# EAGLE design SD_MMC Breakout-v10 (EAGLE 5.10)
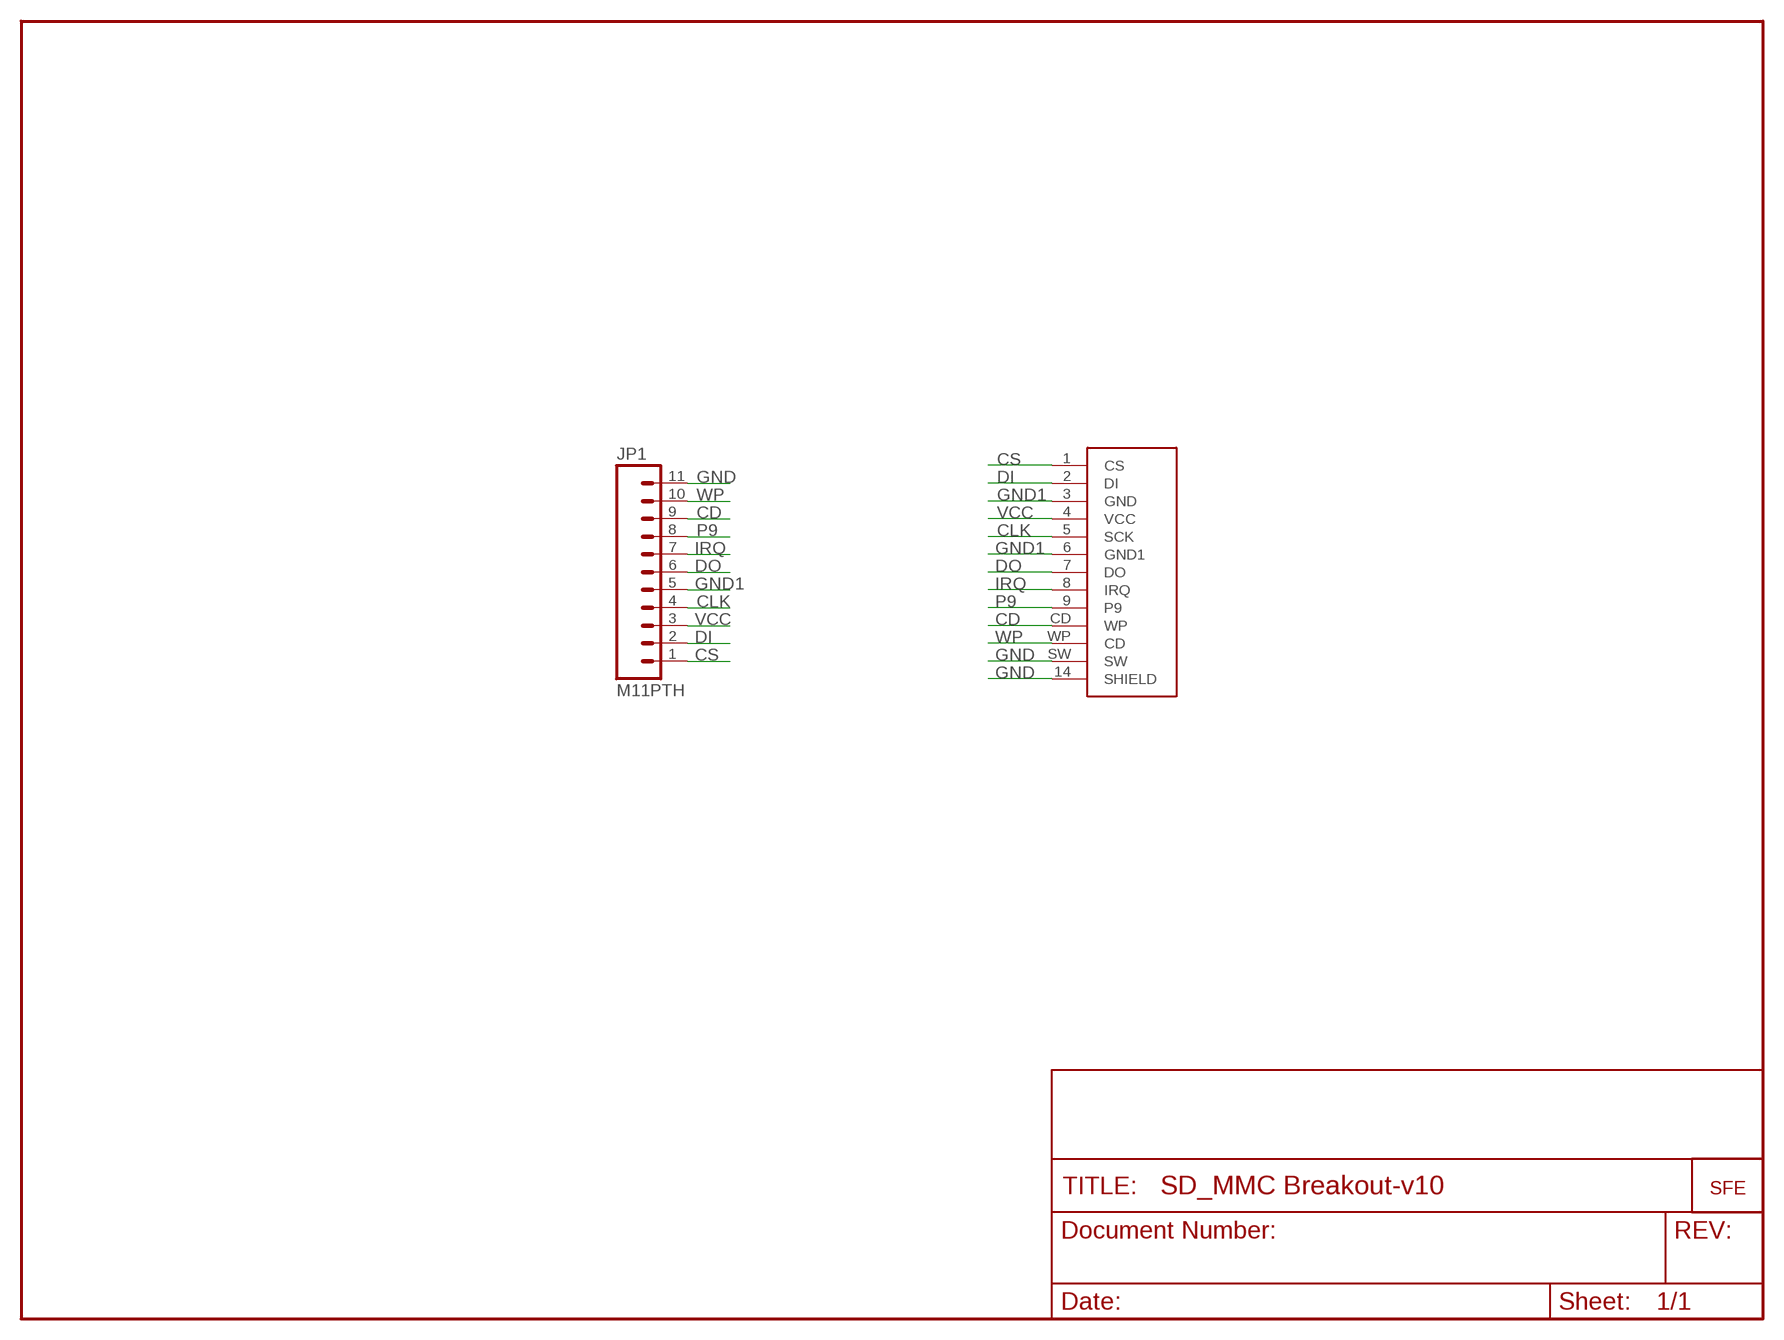
[diagram p0: schematic, sheet 1]

## Parts
JP1  M11PTH  [1X11]
U$1  LOGO-SFENEW  [SFE-NEW-WEBLOGO]
U$2  SD_CARD_SOCKETSD  [SD-MMC_SOCKET-PP]

## Nets
CD: JP1.9 U$2.CD(WP)
CLK: JP1.4 U$2.5(SCK)
CS: JP1.1 U$2.1(CS)
DI: JP1.2 U$2.2(DI)
DO: JP1.6 U$2.7(DO)
GND: JP1.11 U$2.14(SHIELD) U$2.SW
GND1: JP1.5 U$2.3(GND) U$2.6(GND1)
IRQ: JP1.7 U$2.8(IRQ)
P9: JP1.8 U$2.9
VCC: JP1.3 U$2.4(VCC)
WP: JP1.10 U$2.WP(CD)

## Library data of the parts
JP1 = SparkFun:M11: Header 11 Standard 11-pin 0.1" header. Use with straight break away headers (SKU : PRT-00116), right angle break away headers (PRT-00553), swiss pins (PRT-00743), machine pins (PRT-00117), and female headers (PRT-00115).
U$1 = SparkFun:LOGO-SFE: Spark Fun Electronics PCB Logo This is the standard Spark Fun Electronics PCB logo.
U$2 = SparkFun:SD_CARD_SOCKET: SD/MMC Socket Media socket for SD and MMC cards. Push-push type. Schematic element and footprint production proven. Spark Fun Electronics SKU : PRT-00136

## Board
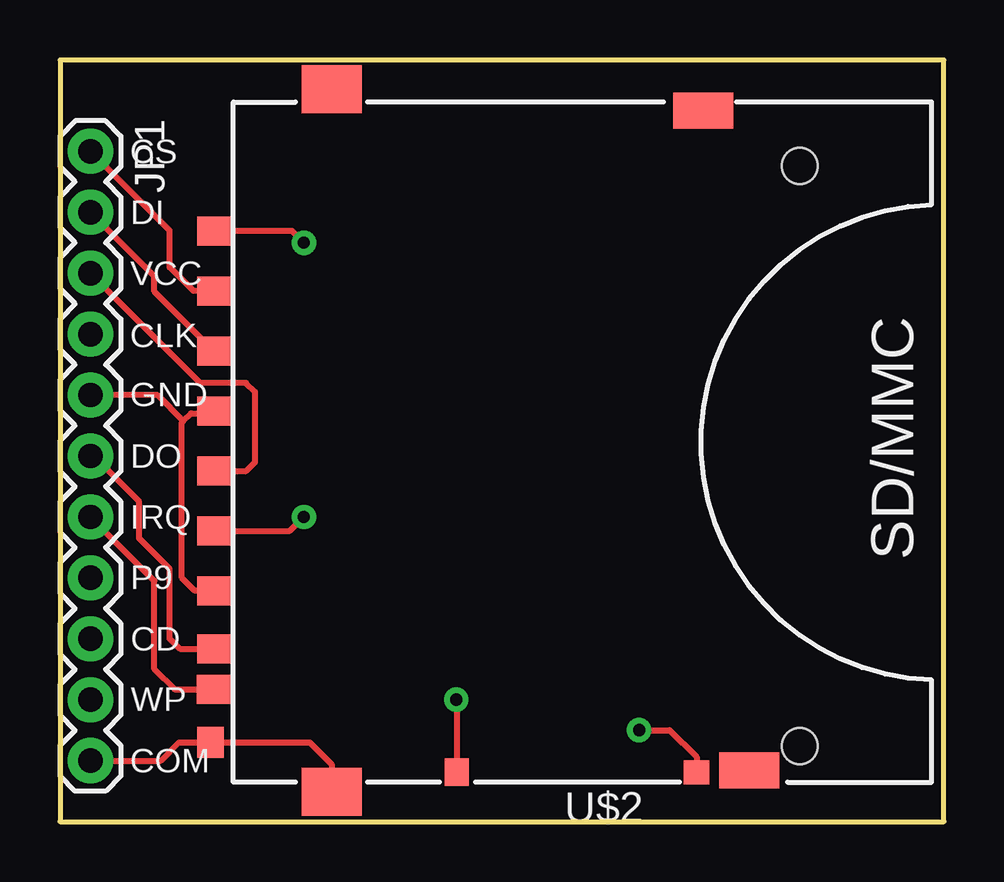
[diagram p1: board, top side]
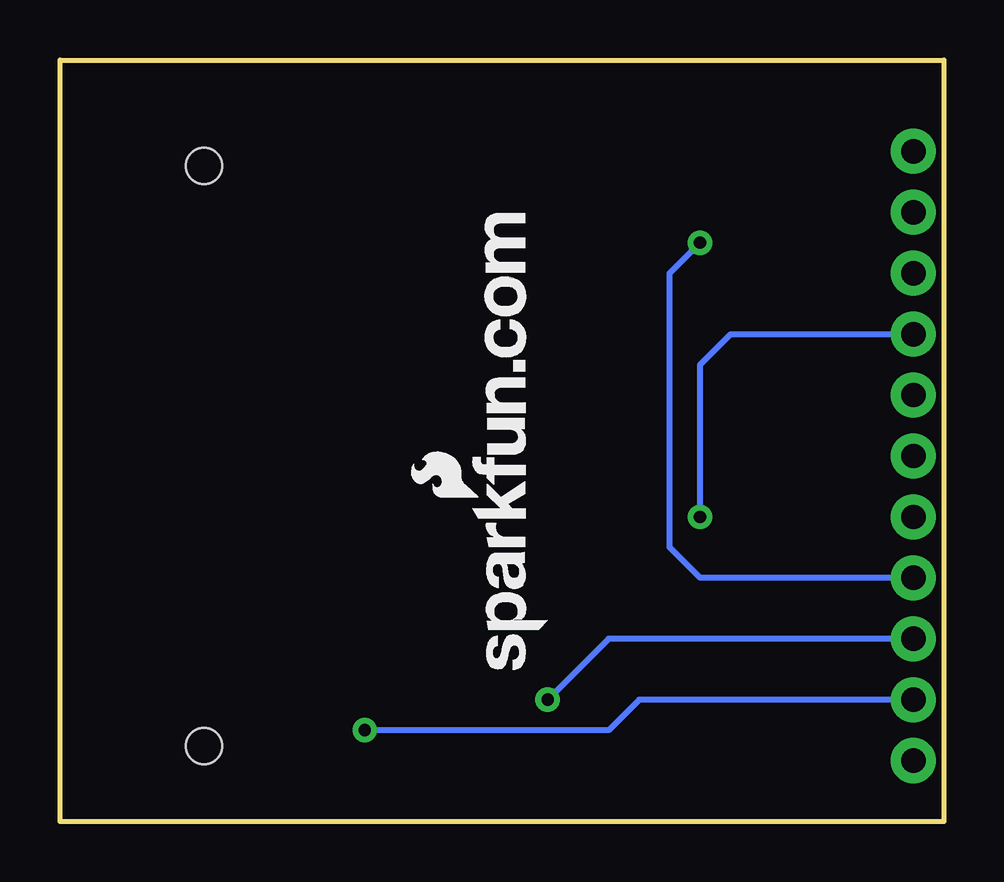
[diagram p2: board, bottom side, seen from below]

Size 36.83 x 31.75 mm. Coordinates in mm from the lower left corner, seen from the top.
Outline: 0,0 36.83,0 36.83,31.75 0,31.75 0,0
Copper layers (1*16): Top 0.0356mm / dielectric 1.5011mm / Bottom 0.0356mm
Design rules "default": minimum track width 8mil, minimum drill 20mil, track to track 8mil, track to pad 8mil, pad to pad 8mil, via to via 8mil, smd to smd 8mil, copper to edge 10mil, drill to drill 8mil, minimum pad ring 12mil, minimum via ring 10mil, stop-mask expansion 4mil, vias tented up to drill 20mil, thermal gap 10mil

### Footprints (pad centres in the part's own frame; a part is rotated, then mirrored left to right if it is on the bottom)
1X11 = drill 1.016 pad 1.88 round: 1 0,0; 2 2.54,0; 3 5.08,0; 4 7.62,0; 5 10.16,0; 6 12.7,0; 7 15.24,0; 8 17.78,0; 9 20.32,0; 10 22.86,0; 11 25.4,0
SD-MMC_SOCKET-PP = smd 1.2 x 1.5: 1 6.88,29.85; 2 4.38,29.85; 3 1.88,29.85; 4 -0.62,29.85; 5 -3.12,29.85; 6 -5.62,29.85; 7 -8.04,29.85; 8 -9.728,29.87; 9 9.38,29.85 | smd 1.5 x 2.5: 12 -13.1,7.6; 13 14.402,9.525 | smd 2 x 2.5: 14 -14,25; 15 15.3,25 | smd 1.15 x 1: CD -13.18,19.8 | smd 1.3 x 1.1: SW -11.938,30.048 | smd 1 x 1.05: WP -13.18,9.8 | hole 1.5: -12.1,5.5; 12.1,5.5

### Placement (x,y rotation side)
JP1  1.27,27.94 270 top
U$1  16.51,6.32 90 bottom
U$2  36.32,15.24 90 top

### Tracks (layer width: path | path; a pad name or v marks a point on that pad's centre or on a via)
CD  (via drill 0.51)
  Top 0.254: U$2.CD 16.52,5.07 v16.51,5.08
  Bottom 0.254: JP1.9 13.97,7.62 v16.51,5.08
CLK  (via drill 0.51)
  Top 0.254: U$2.5 9.58,12.12 v10.16,12.7
  Bottom 0.254: v10.16,12.7 10.16,19.05 8.89,20.32 JP1.4
CS
  Top 0.254: JP1.1 4.57,24.64 4.57,23.11 5.57,22.12 U$2.1
DI
  Top 0.254: U$2.2 6.42,19.62 3.94,22.1 3.94,22.73 JP1.2
DO
  Top 0.254: U$2.7 4.99,7.2 4.57,7.62 4.57,10.54 3.3,11.81 3.3,13.34 1.4,15.24 JP1.6
GND
  Top 0.254: JP1.11 4.19,2.54 4.95,3.3 U$2.SW 10.41,3.3 11.32,2.39 U$2.14
GND1
  Top 0.254: U$2.6 5.62,9.62 5.08,10.16 5.08,16.64 5.14,16.7 | 5.14,16.7 5.46,17.02 6.48,17.02 6.47,17.02 U$2.3 | JP1.5 4.06,17.78 5.14,16.7
IRQ
  Top 0.254: U$2.8 4.78,5.51 3.94,6.35 3.94,10.03 JP1.7
P9  (via drill 0.51)
  Top 0.254: U$2.9 9.67,24.62 v10.16,24.13
  Bottom 0.254: JP1.8 10.16,10.16 11.43,11.43 11.43,22.86 v10.16,24.13
VCC
  Top 0.254: U$2.4 7.76,14.62 8.13,14.99 8.13,17.91 7.75,18.29 5.84,18.29 JP1.3
WP  (via drill 0.51)
  Top 0.254: U$2.WP 26.52,2.69 25.4,3.81 v24.13,3.81
  Bottom 0.254: JP1.10 12.7,5.08 13.97,3.81 v24.13,3.81

### Text on the board
tPlace: CS | DI | VCC | CLK | GND | DO | IRQ | SD/MMC | P9 | CD | WP | COM